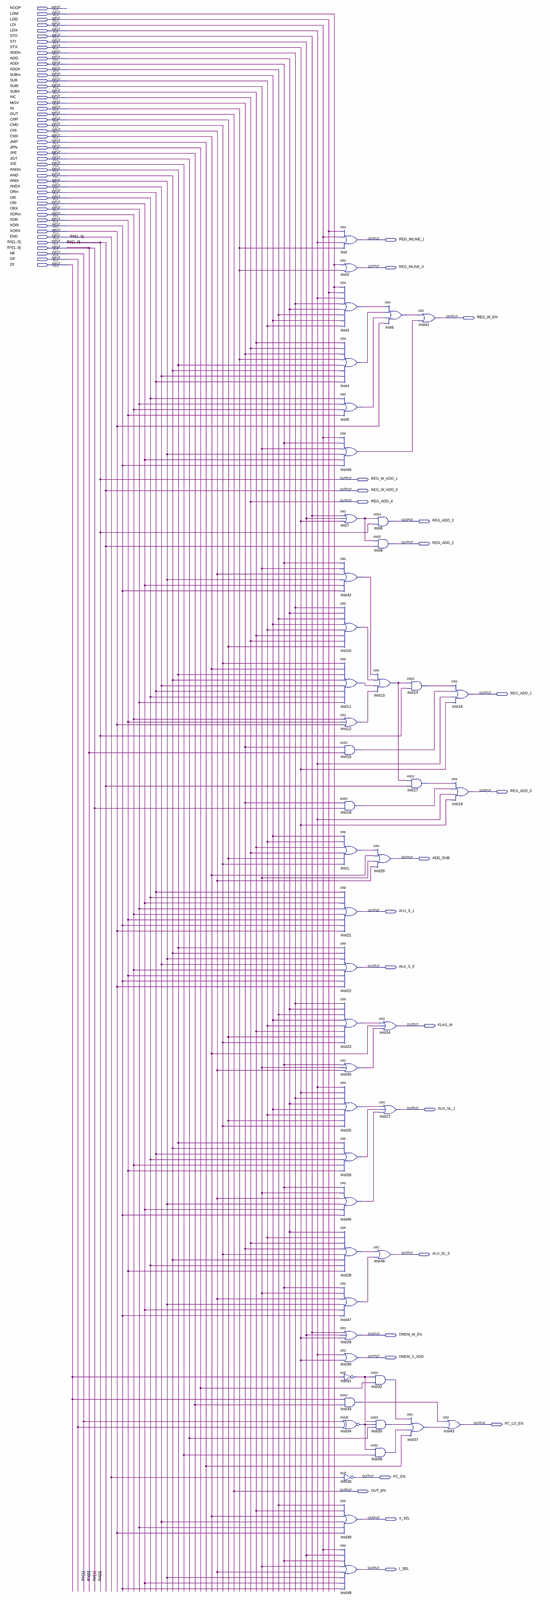
[diagram p0: schematic sheet, whole]
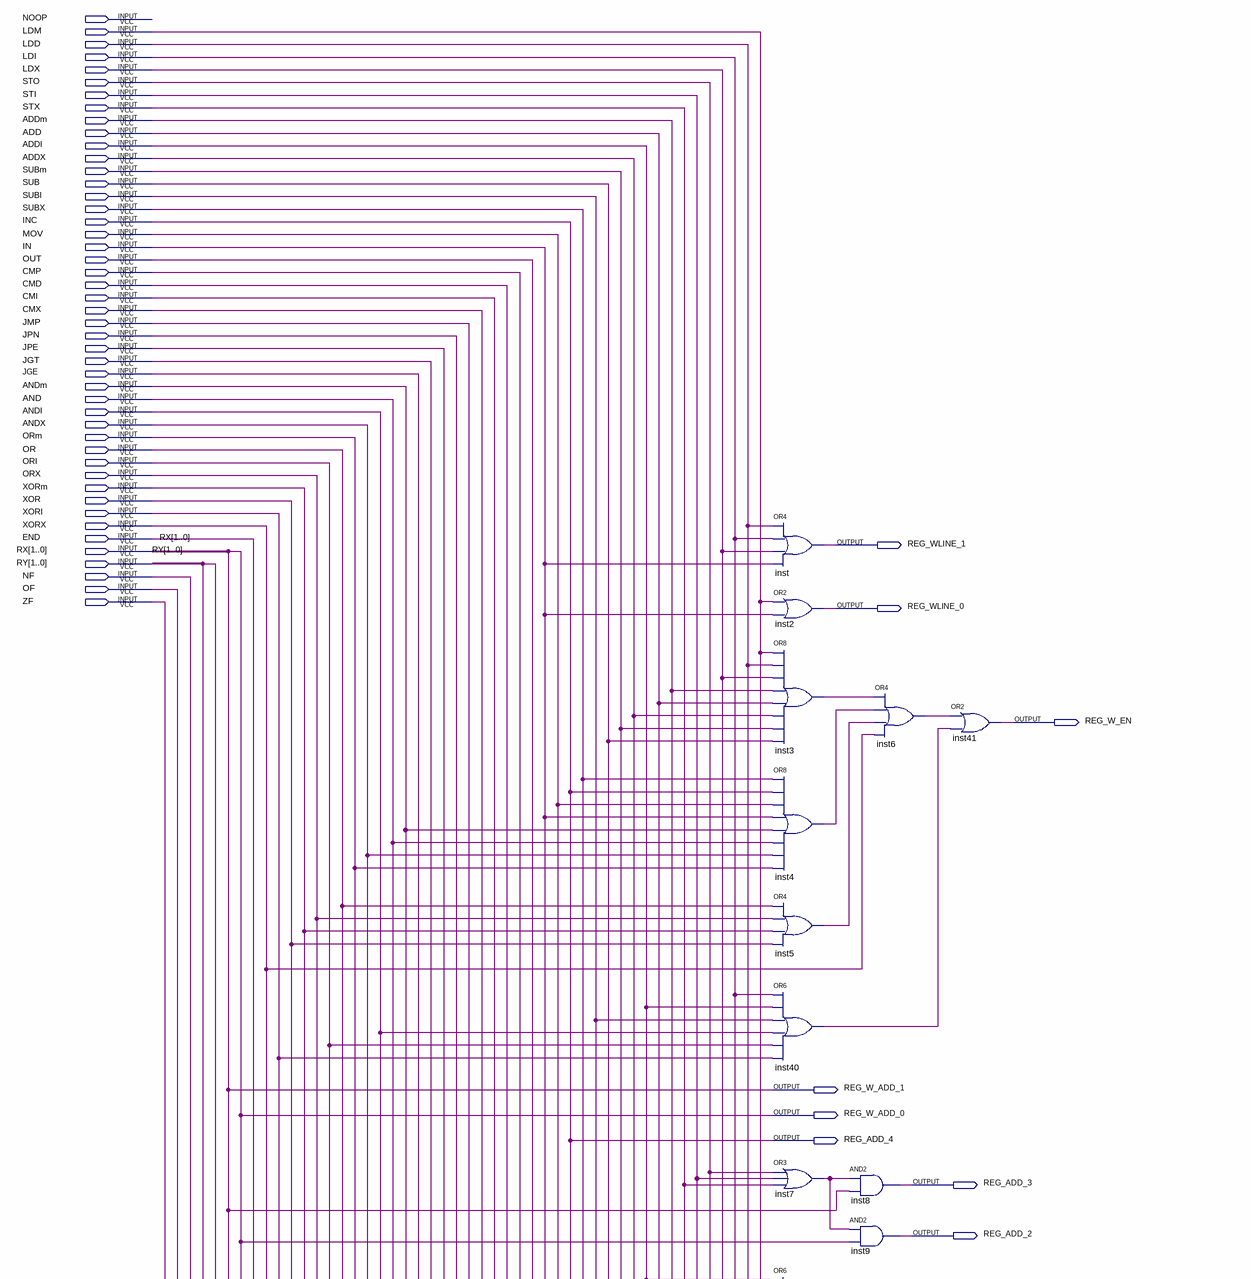
[diagram p1: schematic sheet, upper part]
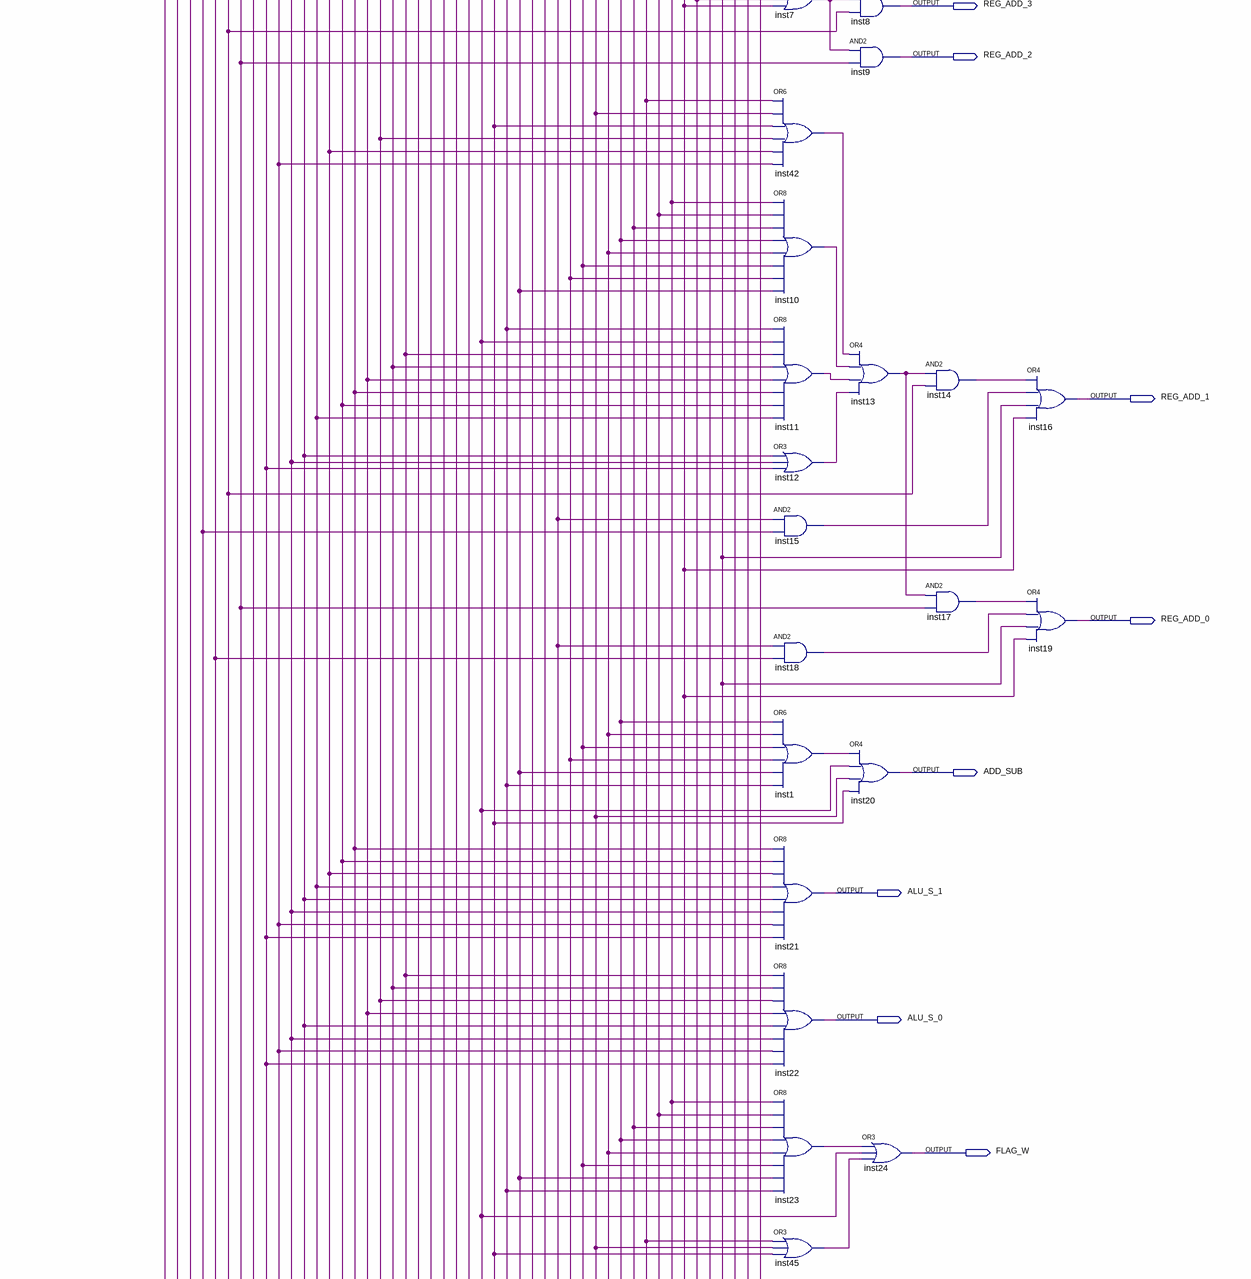
[diagram p2: schematic sheet, middle part]
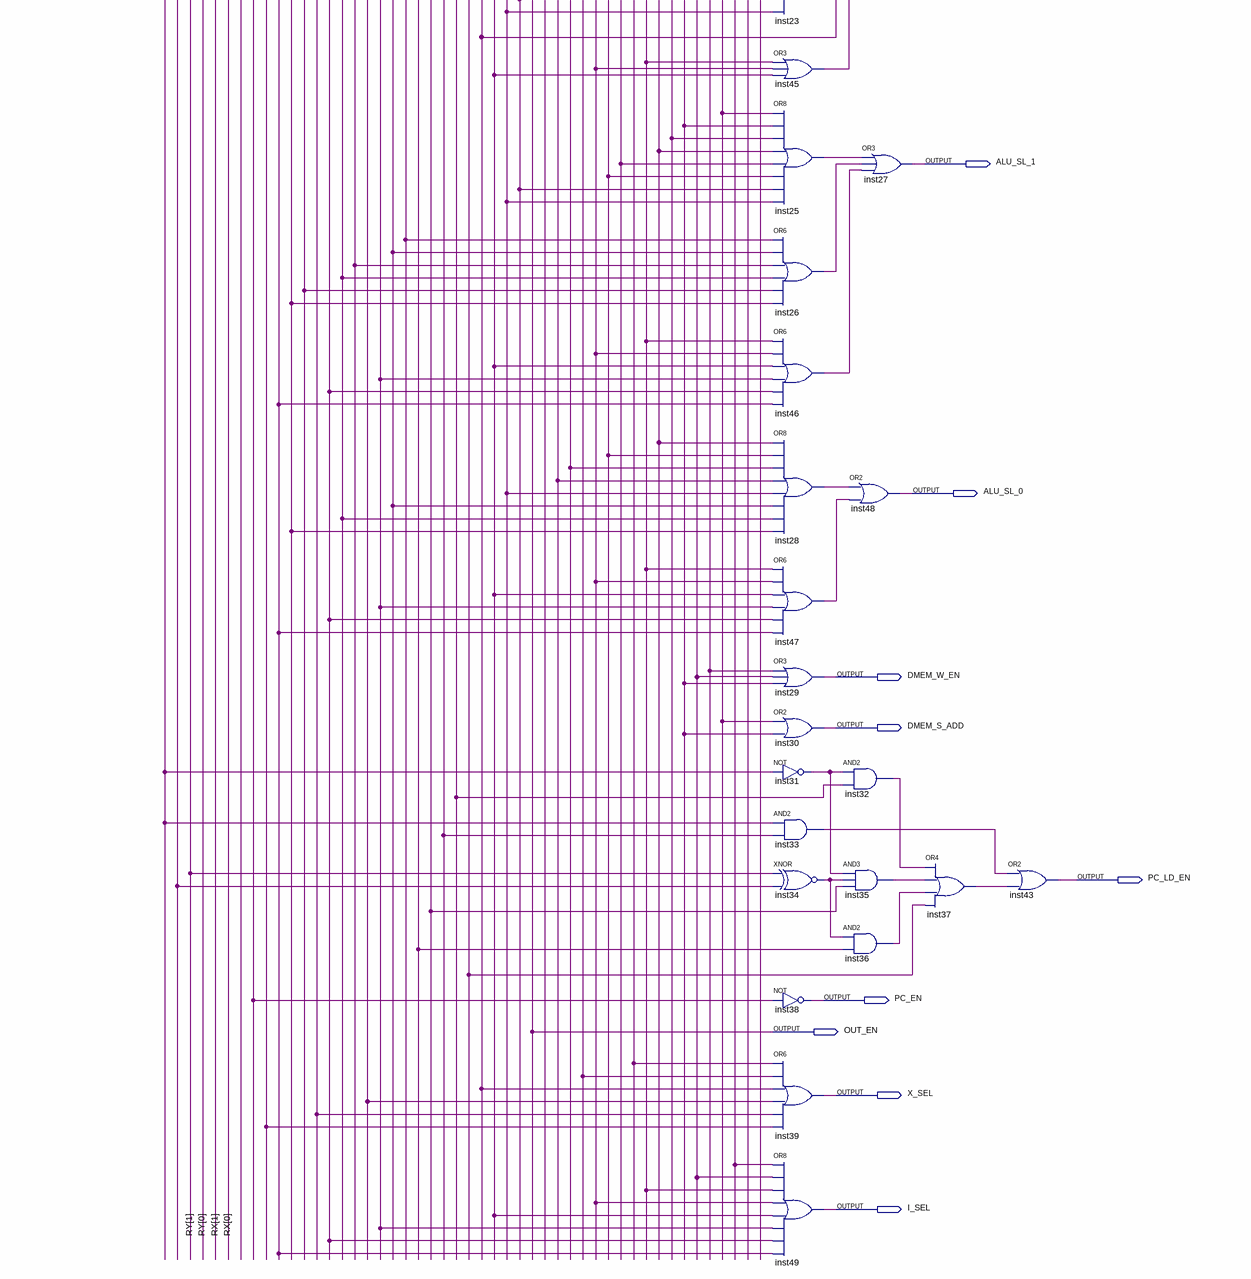
[diagram p3: schematic sheet, lower part]
// Quartus schematic Control.bdf as structural Verilog: 49 symbols, 70 pins
module Control (
  input  NOOP,
  input  LDM,
  input  LDD,
  input  LDI,
  input  LDX,
  input  STO,
  input  STI,
  input  STX,
  input  ADDm,
  input  ADD,
  input  ADDI,
  input  ADDX,
  input  SUBm,
  input  SUB,
  input  SUBI,
  input  SUBX,
  input  INC,
  input  MOV,
  input  IN,
  input  OUT,
  input  CMP,
  input  CMD,
  input  CMI,
  input  CMX,
  input  JMP,
  input  JPN,
  input  JPE,
  input  JGT,
  input  JGE,
  input  ANDm,
  input  AND,
  input  ANDI,
  input  ANDX,
  input  ORm,
  input  OR,
  input  ORI,
  input  ORX,
  input  XORm,
  input  XOR,
  input  XORI,
  input  XORX,
  input  END,
  input  [1:0] RX,
  input  [1:0] RY,
  input  NF,
  input  OF,
  input  ZF,
  output REG_WLINE_1,
  output REG_WLINE_0,
  output REG_W_EN,
  output REG_W_ADD_1,
  output REG_W_ADD_0,
  output REG_ADD_4,
  output REG_ADD_3,
  output REG_ADD_2,
  output REG_ADD_1,
  output REG_ADD_0,
  output ADD_SUB,
  output ALU_S_1,
  output ALU_S_0,
  output FLAG_W,
  output ALU_SL_1,
  output ALU_SL_0,
  output DMEM_W_EN,
  output DMEM_S_ADD,
  output PC_LD_EN,
  output PC_EN,
  output OUT_EN,
  output X_SEL,
  output I_SEL
);

  wire inst1_out, inst3_out, inst4_out, inst5_out, inst6_out, inst7_out, inst10_out, inst11_out, inst12_out,
       inst13_out, inst14_out, inst15_out, inst17_out, inst18_out, inst23_out, inst25_out, inst26_out,
       inst28_out, inst31_out, inst32_out, inst33_out, inst34_out, inst35_out, inst36_out, inst37_out,
       inst40_out, inst42_out, inst45_out, inst46_out, inst47_out;

  or inst (REG_WLINE_1, LDD, LDI, LDX, IN);
  or inst2 (REG_WLINE_0, LDM, IN);
  or inst3 (inst3_out, LDM, LDD, LDX, ADDm, ADD, ADDX, SUBm, SUB);
  or inst4 (inst4_out, SUBX, INC, MOV, IN, ANDm, AND, ANDX, ORm);
  or inst5 (inst5_out, OR, ORX, XORm, XOR);
  or inst40 (inst40_out, LDI, ADDI, SUBI, ANDI, ORI, XORI);
  or inst7 (inst7_out, STO, STI, STX);
  or inst42 (inst42_out, ADDI, SUBI, CMI, ANDI, ORI, XORI);
  or inst10 (inst10_out, ADDm, ADD, ADDX, SUBm, SUB, SUBX, INC, CMP);
  or inst11 (inst11_out, CMD, CMX, ANDm, AND, ANDX, ORm, OR, ORX);
  or inst12 (inst12_out, XORm, XOR, XORX);
  and inst15 (inst15_out, MOV, RY[1]);
  and inst18 (inst18_out, MOV, RY[0]);
  or inst1 (inst1_out, SUBm, SUB, SUBX, INC, CMP, CMD);
  or inst21 (ALU_S_1, ORm, OR, ORI, ORX, XORm, XOR, XORI, XORX);
  or inst22 (ALU_S_0, ANDm, AND, ANDI, ANDX, XORm, XOR, XORI, XORX);
  or inst23 (inst23_out, ADDm, ADD, ADDX, SUBm, SUB, SUBX, CMP, CMD);
  or inst45 (inst45_out, ADDI, SUBI, CMI);
  or inst25 (inst25_out, LDX, STX, ADDm, ADD, SUBm, SUB, CMP, CMD);
  or inst26 (inst26_out, ANDm, AND, ORm, OR, XORm, XOR);
  or inst46 (inst46_out, ADDI, SUBI, CMI, ANDI, ORI, XORI);
  or inst28 (inst28_out, ADD, SUB, INC, MOV, CMD, AND, OR, XOR);
  or inst47 (inst47_out, ADDI, SUBI, CMI, ANDI, ORI, XORI);
  or inst29 (DMEM_W_EN, STO, STI, STX);
  or inst30 (DMEM_S_ADD, LDX, STX);
  not inst31 (inst31_out, ZF);
  and inst33 (inst33_out, ZF, JPE);
  xnor inst34 (inst34_out, NF, OF);
  not inst38 (PC_EN, END);
  or inst39 (X_SEL, ADDX, SUBX, CMX, ANDX, ORX, XORX);
  or inst49 (I_SEL, LDI, STI, ADDI, SUBI, CMI, ANDI, ORI, XORI);
  or inst6 (inst6_out, inst3_out, inst4_out, inst5_out, XORX);
  and inst8 (REG_ADD_3, inst7_out, RX[1]);
  and inst9 (REG_ADD_2, inst7_out, RX[0]);
  or inst13 (inst13_out, inst42_out, inst10_out, inst11_out, inst12_out);
  or inst20 (ADD_SUB, inst1_out, CMX, SUBI, CMI);
  or inst24 (FLAG_W, inst23_out, CMX, inst45_out);
  or inst27 (ALU_SL_1, inst25_out, inst26_out, inst46_out);
  or inst48 (ALU_SL_0, inst28_out, inst47_out);
  and inst32 (inst32_out, inst31_out, JPN);
  and inst35 (inst35_out, inst31_out, inst34_out, JGT);
  and inst36 (inst36_out, inst34_out, JGE);
  and inst14 (inst14_out, inst13_out, RX[1]);
  and inst17 (inst17_out, inst13_out, RX[0]);
  or inst37 (inst37_out, inst32_out, inst35_out, inst36_out, JMP);
  or inst41 (REG_W_EN, inst6_out, inst40_out);
  or inst16 (REG_ADD_1, inst14_out, inst15_out, LDX, STX);
  or inst19 (REG_ADD_0, inst17_out, inst18_out, LDX, STX);
  or inst43 (PC_LD_EN, inst33_out, inst37_out);

  assign OUT_EN = OUT;
  assign REG_ADD_4 = INC;
  assign REG_W_ADD_0 = RX[0];
  assign REG_W_ADD_1 = RX[1];
endmodule
